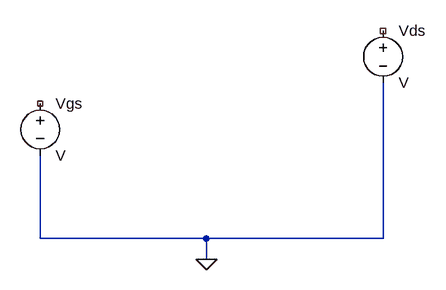
[diagram p0: schematic Draft4.asc]
Draft4.asc, the LTspice schematic file:
Version 4
SHEET 1 880 680
WIRE 96 352 96 224
WIRE 352 352 96 352
WIRE 624 352 624 112
WIRE 624 352 352 352
WIRE 352 384 352 352
FLAG 352 384 0
SYMBOL voltage 96 128 R0
SYMATTR InstName Vgs
SYMBOL voltage 624 16 R0
SYMATTR InstName Vds

The netlist it stands for:
* Draft4.asc
Vgs NC_01 0 V
Vds NC_02 0 V
.backanno
.end